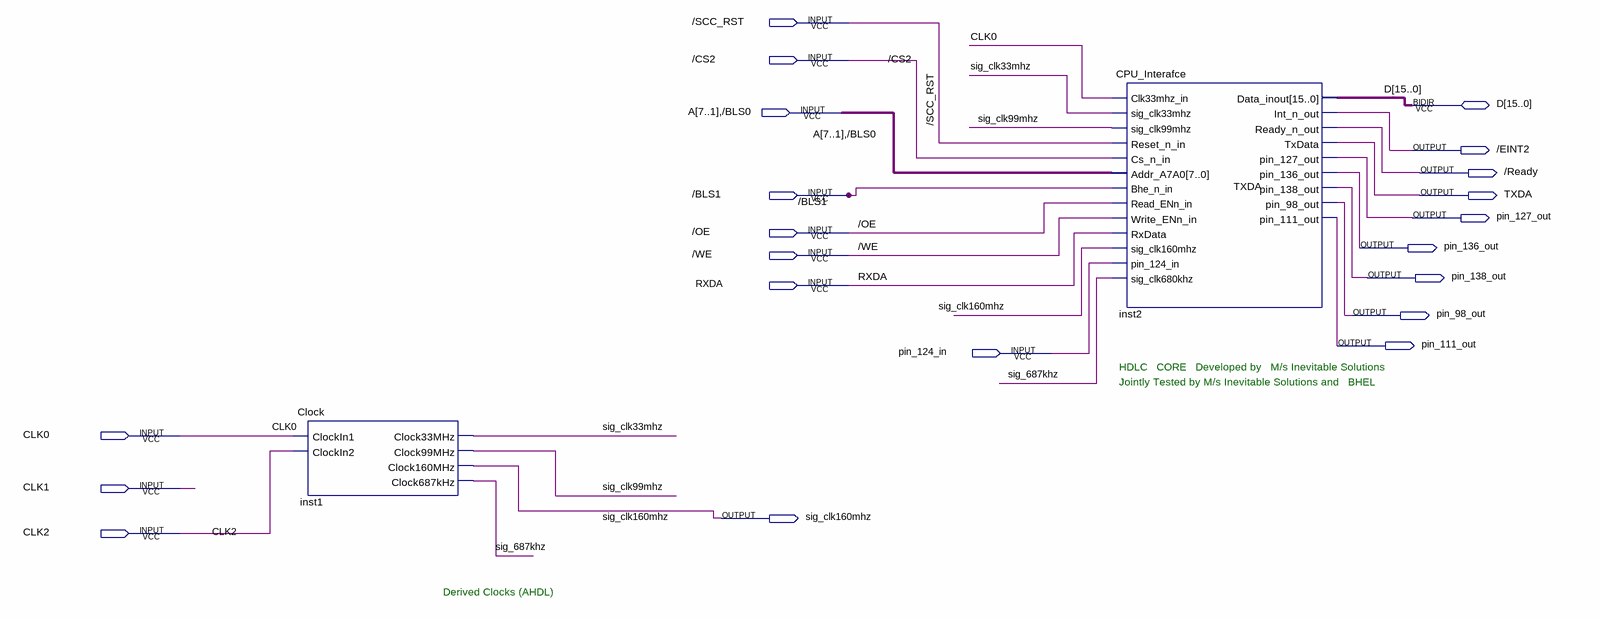
[diagram p0: schematic sheet]
// Quartus schematic amc1feb22.bdf as structural Verilog: 2 symbols, 21 pins
module amc1feb22 (
  input  \/SCC_RST ,
  input  \/CS2 ,
  input  [7:1] A,
  input  \/BLS0 ,
  input  \/BLS1 ,
  input  \/OE ,
  input  \/WE ,
  input  RXDA,
  input  pin_124_in,
  input  CLK0,
  input  CLK1,
  input  CLK2,
  inout  [15:0] D,
  output \/EINT2 ,
  output \/Ready ,
  output TXDA,
  output pin_127_out,
  output pin_136_out,
  output pin_138_out,
  output pin_98_out,
  output pin_111_out,
  output sig_clk160mhz
);

  wire sig_687khz, sig_clk33mhz, sig_clk99mhz;

  Clock inst1 (
    .ClockIn1(CLK0), .ClockIn2(CLK2), .Clock33MHz(sig_clk33mhz), .Clock99MHz(sig_clk99mhz),
    .Clock160MHz(sig_clk160mhz), .Clock687kHz(sig_687khz));
  CPU_Interafce inst2 (
    .Clk33mhz_in(CLK0), .sig_clk33mhz(sig_clk33mhz), .sig_clk99mhz(sig_clk99mhz), .Reset_n_in(\/SCC_RST ),
    .Cs_n_in(\/CS2 ), .Addr_A7A0({A, \/BLS0 }), .Bhe_n_in(\/BLS1 ), .Read_ENn_in(\/OE ),
    .Write_ENn_in(\/WE ), .RxData(RXDA), .sig_clk160mhz(sig_clk160mhz), .pin_124_in(pin_124_in),
    .sig_clk680khz(sig_687khz), .Int_n_out(\/EINT2 ), .Ready_n_out(\/Ready ), .TxData(TXDA),
    .pin_127_out(pin_127_out), .pin_136_out(pin_136_out), .pin_138_out(pin_138_out), .pin_98_out(pin_98_out),
    .pin_111_out(pin_111_out), .Data_inout(D));

  // Notes on the sheet:
  //   HDLC   CORE   Developed by   M/s Inevitable Solutions
  //   Jointly Tested by M/s Inevitable Solutions and   BHEL
  //                       Derived Clocks (AHDL)  
endmodule
